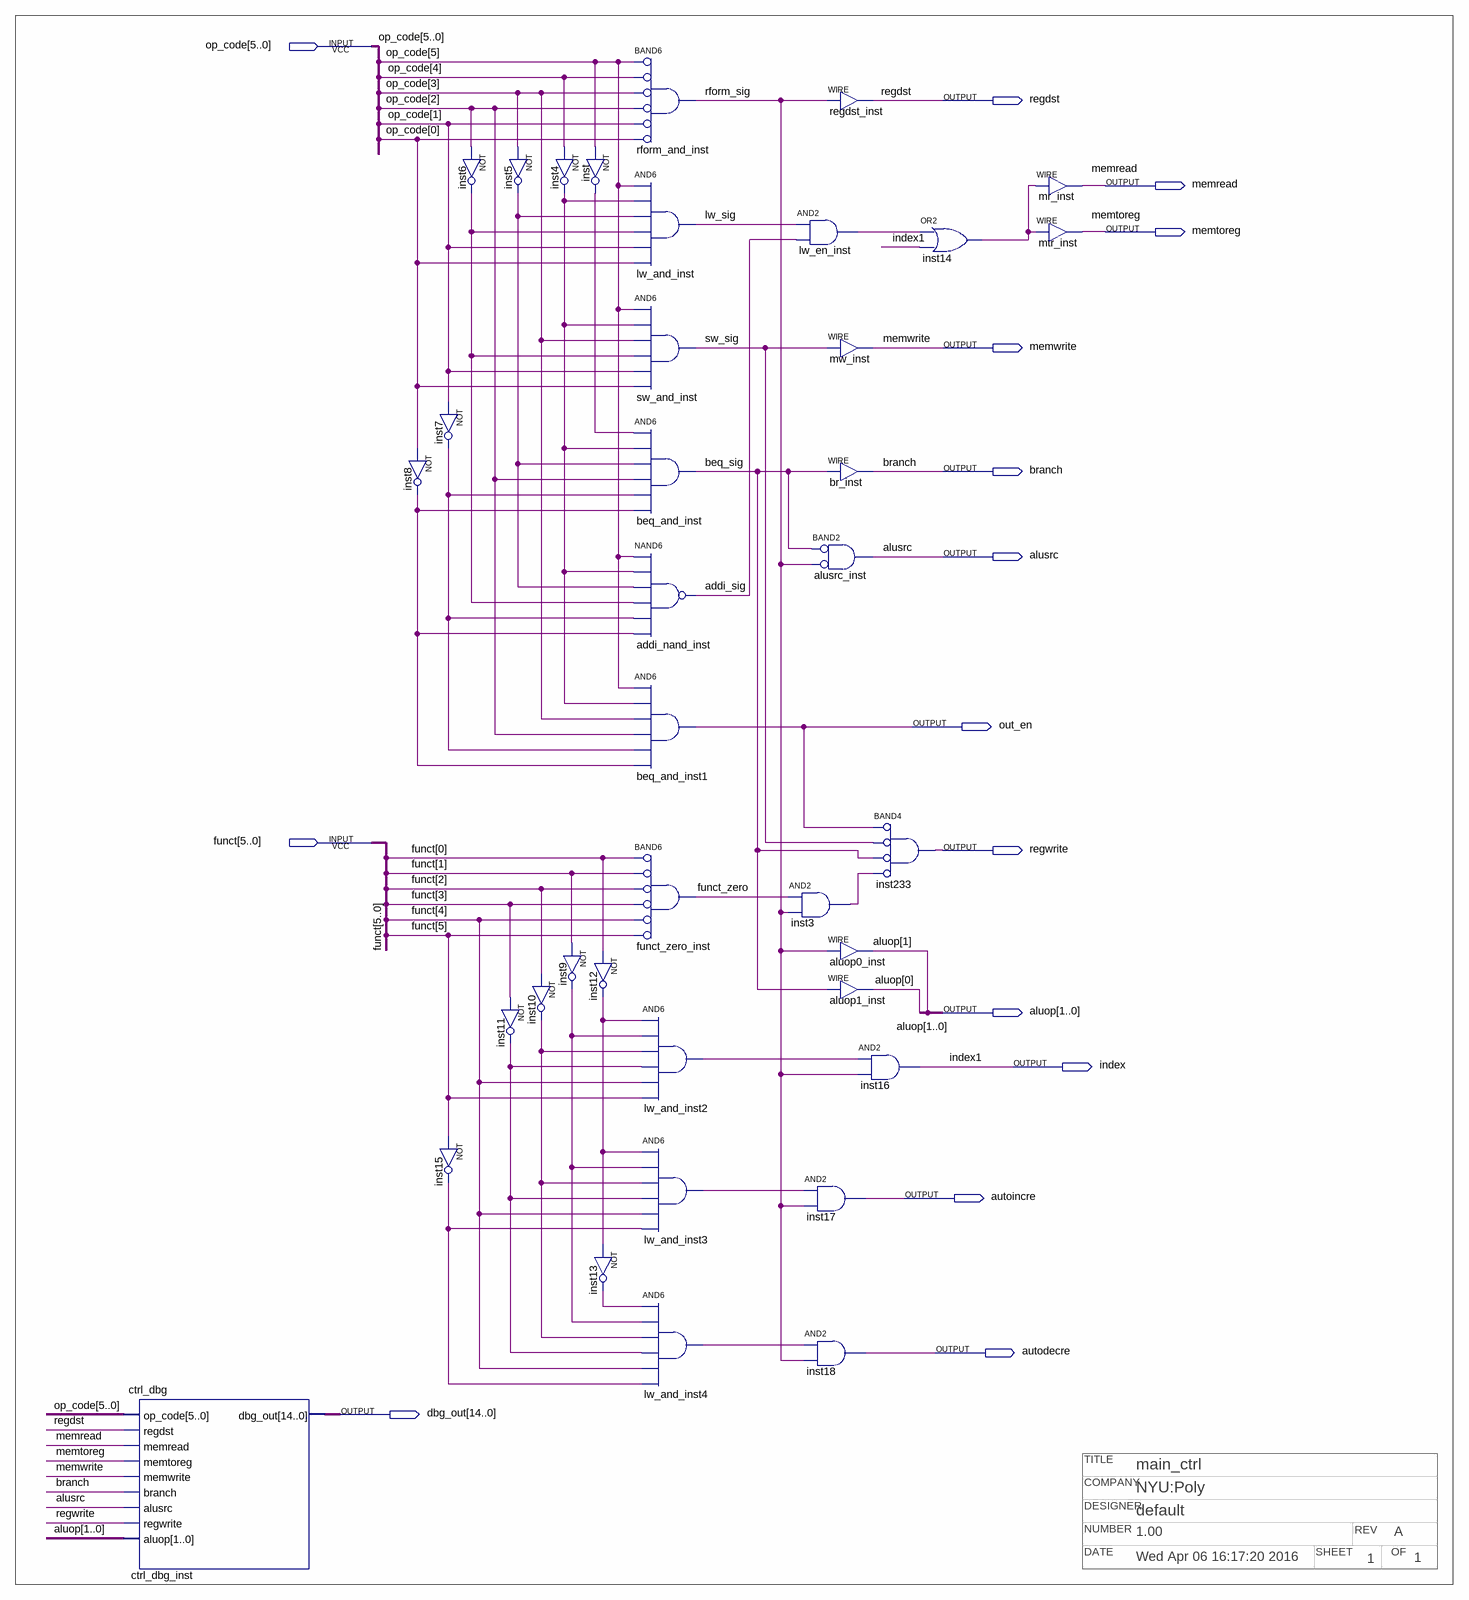
[diagram p0: schematic sheet]
// Quartus schematic main_ctrl.bdf as structural Verilog: 38 symbols, 15 pins
// Title block: COMPANY: NYU:Poly; DATE: Wed Apr 06 16:17:20 2016; DESIGNER: default; NUMBER: 1.00; OF: 1; REV: A; SHEET: 1; TITLE: main_ctrl
module main_ctrl (
  input  [5:0] op_code,
  input  [5:0] funct,
  output regdst,
  output memread,
  output memtoreg,
  output memwrite,
  output branch,
  output alusrc,
  output out_en,
  output regwrite,
  output [1:0] aluop,
  output index,
  output autoincre,
  output autodecre,
  output [14:0] dbg_out
);

  wire addi_sig, beq_sig, funct_zero, inst9_out, inst10_out, inst11_out, inst12_out, inst13_out, inst14_out,
       inst15_out, lw_and_inst2_out, lw_and_inst3_out, lw_and_inst4_out, lw_en_inst_out, lw_sig, nop_op,
       op_code_0_not, op_code_1_not, op_code_2_not, op_code_3_not, op_code_4_not, op_code_5_not, rform_sig,
       sw_sig;

  ctrl_dbg ctrl_dbg_inst (
    .op_code(op_code), .regdst(regdst), .memread(memread), .memtoreg(memtoreg), .memwrite(memwrite),
    .branch(branch), .alusrc(alusrc), .regwrite(regwrite), .aluop(aluop), .dbg_out(dbg_out));
  not inst8 (op_code_0_not, op_code[0]);
  not inst6 (op_code_2_not, op_code[2]);
  not inst7 (op_code_1_not, op_code[1]);
  not inst15 (inst15_out, funct[5]);
  not inst5 (op_code_3_not, op_code[3]);
  not inst10 (inst10_out, funct[2]);
  not inst11 (inst11_out, funct[3]);
  not inst (op_code_5_not, op_code[5]);
  not inst4 (op_code_4_not, op_code[4]);
  not inst9 (inst9_out, funct[1]);
  not inst12 (inst12_out, funct[0]);
  not inst13 (inst13_out, inst12_out);
  and rform_and_inst (rform_sig, ~op_code[5], ~op_code[4], ~op_code[3], ~op_code[2], ~op_code[1], ~op_code[0]);  // BAND6
  and lw_and_inst (lw_sig, op_code[5], op_code_4_not, op_code_3_not, op_code_2_not, op_code[1], op_code[0]);
  and sw_and_inst (sw_sig, op_code[5], op_code_4_not, op_code[3], op_code_2_not, op_code[1], op_code[0]);
  and beq_and_inst (beq_sig, op_code_5_not, op_code_4_not, op_code_3_not, op_code[2], op_code_1_not, op_code_0_not);
  nand addi_nand_inst (addi_sig, op_code[5], op_code_4_not, op_code_3_not, op_code_2_not, op_code_1_not, op_code_0_not);
  and beq_and_inst1 (out_en, op_code[5], op_code_4_not, op_code[3], op_code[2], op_code_1_not, op_code_0_not);
  and funct_zero_inst (funct_zero, ~funct[0], ~funct[1], ~funct[2], ~funct[3], ~funct[4], ~funct[5]);  // BAND6
  and lw_and_inst2 (lw_and_inst2_out, inst12_out, inst9_out, inst10_out, inst11_out, funct[4], funct[5]);
  and lw_and_inst3 (lw_and_inst3_out, inst12_out, inst9_out, inst10_out, inst11_out, funct[4], inst15_out);
  and lw_and_inst4 (lw_and_inst4_out, inst13_out, inst9_out, inst10_out, inst11_out, funct[4], inst15_out);
  and inst3 (nop_op, funct_zero, rform_sig);
  assign regdst = rform_sig;  // WIRE regdst_inst
  and lw_en_inst (lw_en_inst_out, lw_sig, addi_sig);
  assign memwrite = sw_sig;  // WIRE mw_inst
  assign branch = beq_sig;  // WIRE br_inst
  and alusrc_inst (alusrc, ~beq_sig, ~rform_sig);  // BAND2
  assign aluop[1] = rform_sig;  // WIRE aluop0_inst
  assign aluop[0] = beq_sig;  // WIRE aluop1_inst
  and inst17 (autoincre, lw_and_inst3_out, rform_sig);
  and inst18 (autodecre, lw_and_inst4_out, rform_sig);
  and inst233 (regwrite, ~out_en, ~sw_sig, ~beq_sig, ~nop_op);  // BAND4
  and inst16 (index, lw_and_inst2_out, rform_sig);
  or inst14 (inst14_out, lw_en_inst_out, index);
  assign memread = inst14_out;  // WIRE mr_inst
  assign memtoreg = inst14_out;  // WIRE mtr_inst

  // Other names for the same wires on the sheet: index1 = index
endmodule
